# EAGLE schematic scHnRk_6 (EAGLE 7.5.0)
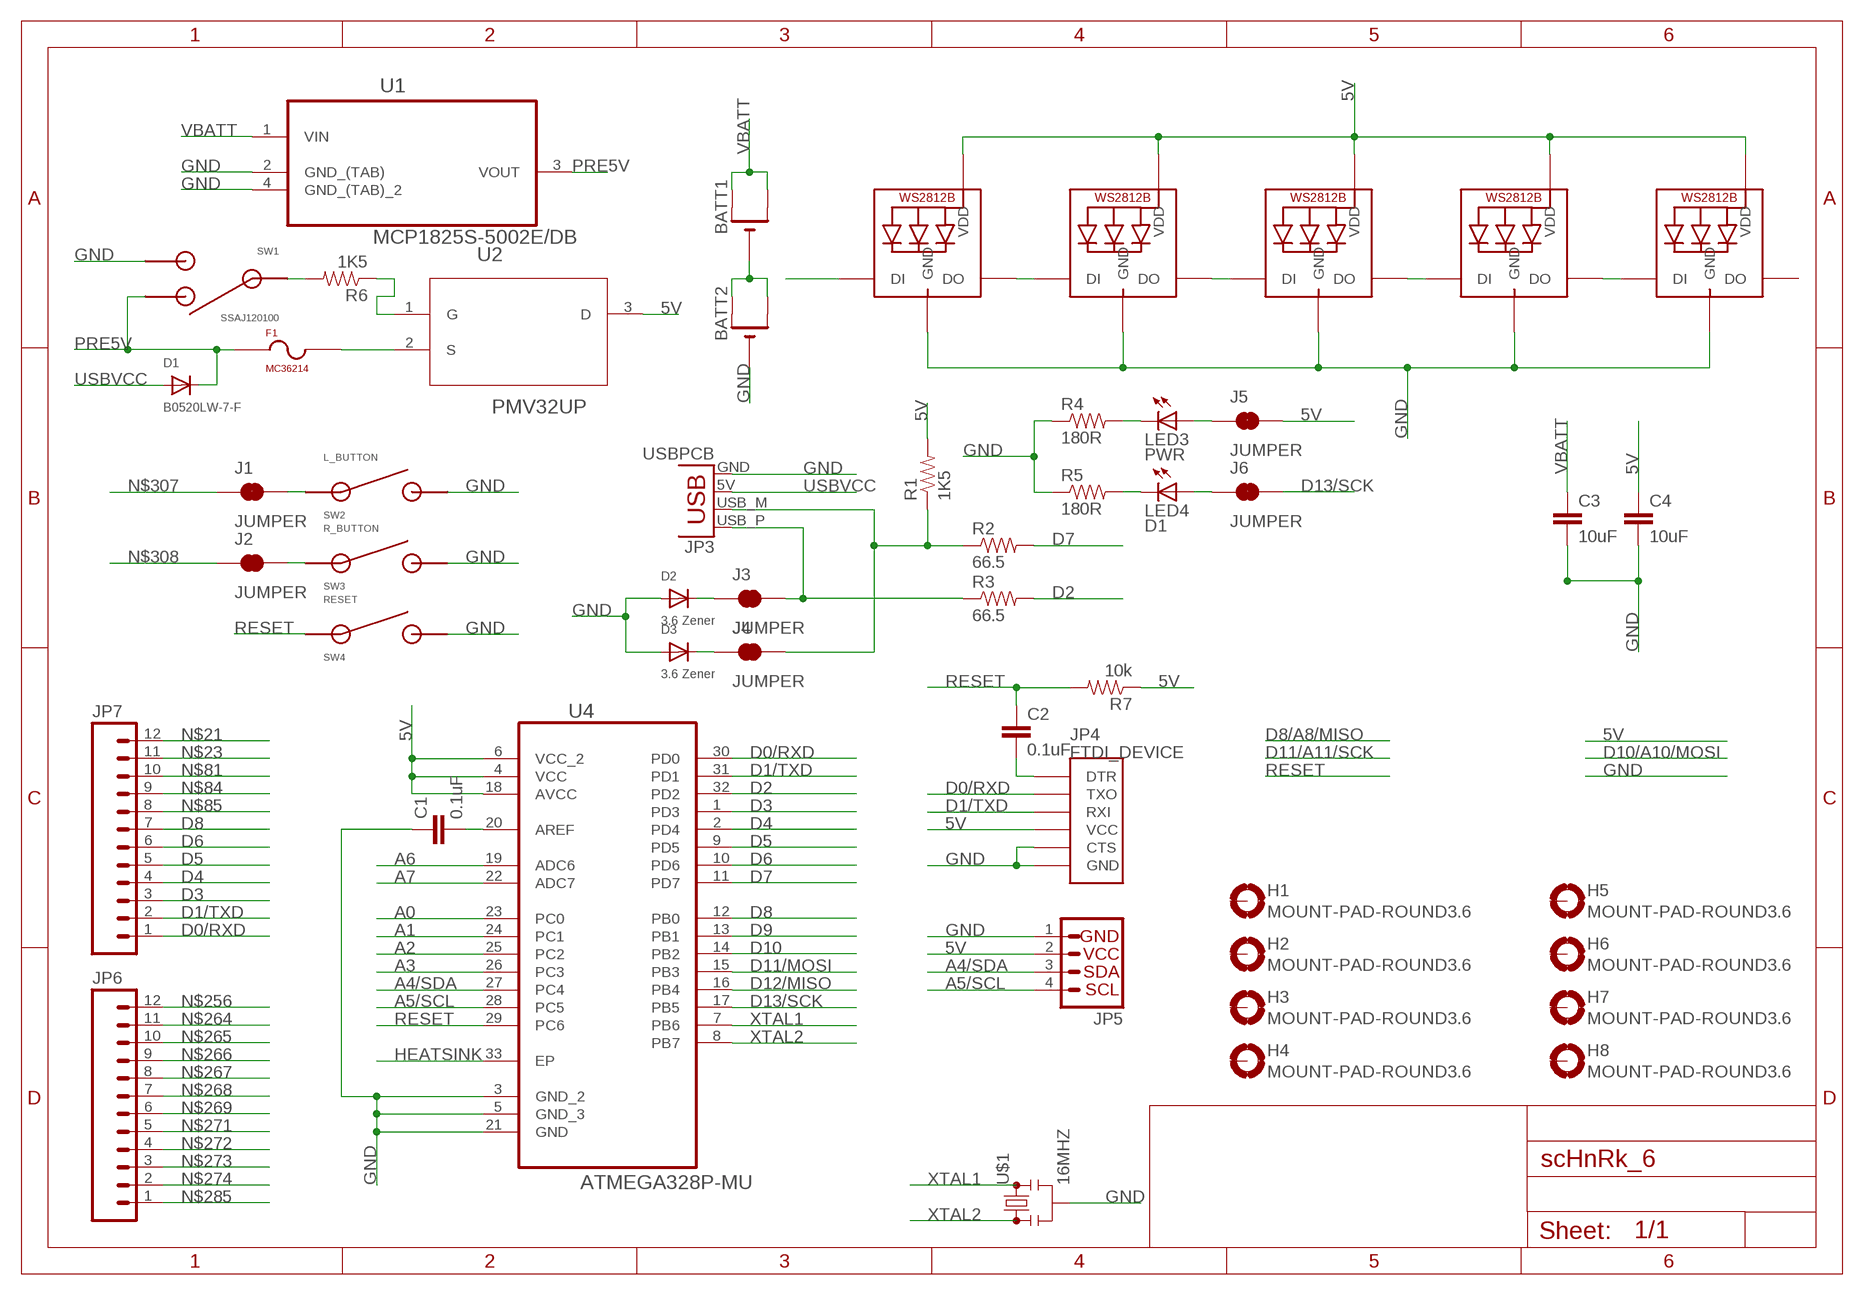
[diagram p0: schematic, sheet 1]

## Parts
BATT1  CR2032SMT  [CR2032-SMD]
BATT2  CR2032SMT  [CR2032-SMD]
C1  0.1uF  CAP0805  [0805]
C2  0.1uF  CAP0805  [0805]
C3  10uF  CAP0805  [0805]
C4  10uF  CAP0805  [0805]
D1  B0520LW-7-F  DIODESOD-123  [SOD-123]
D2  3.6 Zener  DIODESOD-523  [SOD-523]
D3  3.6 Zener  DIODESOD-523  [SOD-523]
F1  MC36214  [MC36214]
H1  MOUNT-PAD-ROUND3.6  [3,6-PAD]
H2  MOUNT-PAD-ROUND3.6  [3,6-PAD]
H3  MOUNT-PAD-ROUND3.6  [3,6-PAD]
H4  MOUNT-PAD-ROUND3.6  [3,6-PAD]
H5  MOUNT-PAD-ROUND3.6  [3,6-PAD]
H6  MOUNT-PAD-ROUND3.6  [3,6-PAD]
H7  MOUNT-PAD-ROUND3.6  [3,6-PAD]
H8  MOUNT-PAD-ROUND3.6  [3,6-PAD]
J1  JUMPER  JUMPER-PAD-2-NC_BY_TRACE  [PAD-JUMPER-2-NC_BY_TRACE_YES_SILK]
J2  JUMPER  JUMPER-PAD-2-NC_BY_TRACE  [PAD-JUMPER-2-NC_BY_TRACE_YES_SILK]
J3  JUMPER  JUMPER-PAD-2-NC_BY_TRACE  [PAD-JUMPER-2-NC_BY_TRACE_YES_SILK]
J4  JUMPER  JUMPER-PAD-2-NC_BY_TRACE  [PAD-JUMPER-2-NC_BY_TRACE_YES_SILK]
J5  JUMPER  JUMPER-PAD-2-NC_BY_TRACE  [PAD-JUMPER-2-NC_BY_TRACE_YES_SILK]
J6  JUMPER  JUMPER-PAD-2-NC_BY_TRACE  [PAD-JUMPER-2-NC_BY_TRACE_YES_SILK]
JP3  USBPCB  [USB-A-PCB]
JP4  FTDI_DEVICE  [FTDI_DEVICE_SIDE]
JP5  I2C_STANDARD  [1X04]
JP6  M12PTH  [1X12]
JP7  M12PTH  [1X12]
LED1  WS2812B5050  [WS2812B]
LED2  WS2812B5050  [WS2812B]
LED3  PWR  LEDCHIPLED_0603  [CHIPLED_0603]
LED4  D1  LEDCHIPLED_0603  [CHIPLED_0603]
LED5  WS2812B5050  [WS2812B]
LED6  WS2812B5050  [WS2812B]
LED7  WS2812B5050  [WS2812B]
R1  1K5  RESISTOR0805-RES  [0805]
R2  66.5  RESISTOR0603-RES  [0603-RES]
R3  66.5  RESISTOR0603-RES  [0603-RES]
R4  180R  RESISTOR0805-RES  [0805]
R5  180R  RESISTOR0805-RES  [0805]
R6  1K5  RESISTOR0805-RES  [0805]
R7  10k  RESISTOR0805-RES  [0805]
SW1  SSAJ120100  [SSAJ120100]
SW2  L_BUTTON  SKRBAGE010  [SKRBAGE010]
SW3  R_BUTTON  SKRBAGE010  [SKRBAGE010]
SW4  RESET  SKRBAGE010  [SKRBAGE010]
U1  MCP1825S-5002E/DB  [SOT230P700X180-4N]
U2  PMV32UP  [SOT95P230X110-3N]
U4  ATMEGA328P-MU  [QFN50P500X500X100-33N]
U$1  16MHZ  RESONATOR16MHZ  [RESONATOR-SMD]

## Nets
5V: C4.1 J5.2 JP4.P$4(VCC) JP5.2 LED1.1-VDD(VDD) LED2.1-VDD(VDD) LED5.1-VDD(VDD) LED6.1-VDD(VDD) LED7.1-VDD(VDD) R1.2 R7.1 U2.3(D) U4.4(VCC) U4.6(VCC_2) U4.18(AVCC)
A0: U4.23(PC0)
A1: U4.24(PC1)
A2: U4.25(PC2)
A3: U4.26(PC3)
A4/SDA: JP5.3 U4.27(PC4)
A5/SCL: JP5.4 U4.28(PC5)
A6: U4.19(ADC6)
A7: U4.22(ADC7)
D0/RXD: JP4.P$2(TXO) JP7.1 U4.30(PD0)
D1/TXD: JP4.P$3(RXI) JP7.2 U4.31(PD1)
D2: R3.2 U4.32(PD2)
D3: JP7.3 U4.1(PD3)
D4: JP7.4 U4.2(PD4)
D5: JP7.5 U4.9(PD5)
D6: JP7.6 U4.10(PD6)
D7: R2.2 U4.11(PD7)
D8: JP7.7 U4.12(PB0)
D9: U4.13(PB1)
D10: U4.14(PB2)
D11/MOSI: U4.15(PB3)
D12/MISO: U4.16(PB4)
D13/SCK: J6.2 U4.17(PB5)
GND: BATT2.- C1.1 C3.2 C4.2 D2.A D3.A JP3.GND JP4.P$5(CTS) JP4.P$6(GND) JP5.1 LED1.3-GND(GND) LED2.3-GND(GND) LED5.3-GND(GND) LED6.3-GND(GND) LED7.3-GND(GND) R4.1 R5.1 SW1.P$2 SW2.P$2 SW2.P$4 SW3.P$2 SW3.P$4 SW4.P$2 SW4.P$4 U1.2(GND_(TAB)) U1.4(GND_(TAB)_2) U4.3(GND_2) U4.5(GND_3) U4.21(GND) U$1.2
HEATSINK: U4.33(EP)
N$1: BATT1.- BATT2.+$1(+) BATT2.+$2(+1)
N$2: J1.2 SW2.P$1 SW2.P$3
N$3: LED1.2-DOUT(DO) LED2.4-DIN(DI)
N$4: LED2.2-DOUT(DO) LED5.4-DIN(DI)
N$5: LED5.2-DOUT(DO) LED6.4-DIN(DI)
N$6: LED6.2-DOUT(DO) LED7.4-DIN(DI)
N$7: R6.2 SW1.P$C
N$8: J2.2 SW3.P$1 SW3.P$3
N$9: D2.K(C) J3.1
N$10: D3.K(C) J4.1
N$15: J4.2 JP3.USB_M(D-) R1.1 R2.1
N$16: J3.2 JP3.USB_P(D+) R3.1
N$20: R6.1 U2.1(G)
N$21: JP7.12
N$22: F1.P$2 U2.2(S)
N$23: JP7.11
N$25: C2.2 JP4.P$1(DTR)
N$26: LED1.4-DIN(DI)
N$28: LED3.C R4.2
N$29: LED4.C R5.2
N$31: J5.1 LED3.A
N$34: J6.1 LED4.A
N$62: C1.2 U4.20(AREF)
N$81: JP7.10
N$84: JP7.9
N$85: JP7.8
N$256: JP6.12
N$264: JP6.11
N$265: JP6.10
N$266: JP6.9
N$267: JP6.8
N$268: JP6.7
N$269: JP6.6
N$271: JP6.5
N$272: JP6.4
N$273: JP6.3
N$274: JP6.2
N$285: JP6.1
N$307: J1.1
N$308: J2.1
PRE5V: D1.C F1.P$1 SW1.P$1 U1.3(VOUT)
RESET: C2.1 R7.2 SW4.P$1 SW4.P$3 U4.29(PC6)
USBVCC: D1.A JP3.5V(VBUS)
VBATT: BATT1.+$1(+) BATT1.+$2(+1) C3.1 U1.1(VIN)
XTAL1: U4.7(PB6) U$1.3
XTAL2: U4.8(PB7) U$1.1
Unconnected: H1.B3,6(MOUNT) H2.B3,6(MOUNT) H3.B3,6(MOUNT) H4.B3,6(MOUNT) H5.B3,6(MOUNT) H6.B3,6(MOUNT) H7.B3,6(MOUNT) H8.B3,6(MOUNT) LED7.2-DOUT(DO)

## Library data of the parts
BATT1 BATT2 = adafruit:CR2032
C1-C4 = SparkFun-Passives:CAP: Capacitor Standard 0603 ceramic capacitor, and 0.1" leaded capacitor.
D1-D3 = adafruit:DIODE: Diode SMADIODE - SMA Surface Mount Package 20V 1A Schottky Diode Digikey: 641-1014-6-ND DO-1N4148 - Through Hole Small Current Diode SOD-123 20V 1 A (.5mV Vf) Schottky Diode - Digikey: MBRX120TPMSCT-ND SOD-323 10V 570mA (.38mV Vf, 3ns) Schottky Diode - Digikey: ZLLS410CT-ND SOD-523 30V 30mA Schottky Diode (RB751S-40TE61) - Digikey: RB751S-40TE61CT-ND SOT23-R/W - SOT23 Package (R = Solder Paste/Reflow Ovens, W = Hand-Soldering) BAT54Film 40V 300mA - Digikey: 497-7162-1-ND
F1 = scHnRk:MC36214
H1-H8 = holes:MOUNT-PAD-ROUND: MOUNTING PAD, round
J1-J6 = SparkFun-Passives:JUMPER-PAD-2-NC_BY_TRACE
JP3 = SparkFun-Connectors:USB: USB Connectors USB-B-PTH is fully proven SKU : PRT-00139/CONN-08278 USB-miniB is fully proven SKU : PRT-00587 USB-A-PCB is untested. USB-A-H is throughly reviewed, but untested. Spark Fun Electronics SKU : PRT-00437 USB-B-SMT is throughly reviewed, but untested. Needs silkscreen touching up. USB-A-S has not been used/tested USB-MB-H has not been used/tested USB-MICROB has been used. CONN-09505
JP4 = SparkFun-Connectors:FTDI_DEVICE: Connector which mates to FTDI basic or FTDI cable.
JP5 = SparkFun-Connectors:I2C_STANDARD: SparkFun has standardized on a pinout for all I2C based sensor breakouts. This pinout allows I2C boards to be plugged directly into the headers on Arduino Uno compatible boards, and to be daisy chained easily.
JP6 JP7 = SparkFun-Connectors:M12: Header 12 Standard 12-pin 0.1" header. Use with straight break away headers (SKU : PRT-00116), right angle break away headers (PRT-00553), swiss pins (PRT-00743), machine pins (PRT-00117), and female headers (PRT-00115).
LED1 LED2 LED5-LED7 = adafruit:WS2812B
LED3 LED4 = adafruit:LED: LED OSRAM: - CHIPLED LG R971, LG N971, LY N971, LG Q971, LY Q971, LO R971, LY R971 LH N974, LH R974 LS Q976, LO Q976, LY Q976 LO Q996 - Hyper CHIPLED LW Q18S LB Q993, LB Q99A, LB R99A - SideLED LS A670, LO A670, LY A670, LG A670, LP A670 LB A673, LV A673, LT A673, LW A673 LH A674 LY A675 LS A676, LA A676, LO A676, LY A676, LW A676 LS A679, LY A679, LG A679 - Hyper Micro SIDELED® LS Y876, LA Y876, LO Y876, LY Y876 LT Y87S - SmartLED LW L88C, LW L88S LB L89C, LB L89S, LG L890 LS L89K, LO L89K, LY L89K LS L896, LA L896, LO L896, LY L896 - TOPLED LS T670, LO T670, LY T670, LG T670, LP T670 LSG T670, LSP T670, LSY T670, LOP T670, LYG T670 LG T671, LOG T671, LSG T671 LB T673, LV T673, LT T673, LW T673 LH T674 LS T676, LA T676, LO T676, LY T676, LB T676, LH T676, LSB T676, LW T676 LB T67C, LV T67C, LT T67C, LS T67K, LO T67K, LY T67K, LW E67C LS E67B, LA E67B, LO E67B, LY E67B, LB E67C, LV E67C, LT E67C LW T67C LS T679, LY T679, LG T679 LS T770, LO T770, LY T770, LG T770, LP T770 LB T773, LV T773, LT T773, LW T773 LH T774 LS E675, LA E675, LY E675, LS T675 LS T776, LA T776, LO T776, LY T776, LB T776 LHGB T686 LT T68C, LB T68C - Hyper Mini TOPLED® LB M676 - Mini TOPLED Santana® LG M470 LS M47K, LO M47K, LY M47K Source: http://www.osram.convergy.de/
R1-R7 = SparkFun-Passives:RESISTOR: Resistor Basic schematic elements and footprints for 0603, 1206, and PTH resistors.
SW1 = scHnRk:SSAJ120100
SW2-SW4 = scHnRk:SKRBAGE010
U1 = Microchip_By_element14_Batch_1:MCP1825S-5002E/DB: IC, LDO, 5.0V, 500MA; MPN: MCP1825S-5002E/DB; OC_FARNELL: 1578407; OC_NEWARK: 26M9964; PACKAGE: SOT-223-3; SUPPLIER: Microchip
U2 = NXP_By_element14_Batch_1:PMV32UP: P-channel Trench MOSFET; MPN: PMV32UP; OC_FARNELL: 1894624; OC_NEWARK: 47T2356; PACKAGE: SOT-3; SUPPLIER: NXP Semiconductors
U4 = Atmel_By_element14_Batch_1-00:ATMEGA328P-MU: Programmable Flash; MPN: ATMEGA328P-MU; OC_FARNELL: 1748522; OC_NEWARK: 26R2526; PACKAGE: QFN-32; SUPPLIER: Atmel
U$1 = SparkFun-FreqCtrl:RESONATOR: Resonator Small SMD resonator. Used, eg, on the Arduino Pro/ Pro Mini boards. 8MHz- XTAL-08895 16MHz- XTAL-08900; PROD_ID: XTAL-08900

## Net classes
0 default: clearance 25.4 mm